# Altium schematic sheet CW521_BallisticGel_Connectors.SchDoc: SRAM Target for EM Fault Testing
size Letter; Organization: NewAE Technology Inc.; Address1: 1083 Queen St., Suite 196; Address2: Halifax; Address3: NS; Address4: Canada B3H 0B2; SheetApproved: YES
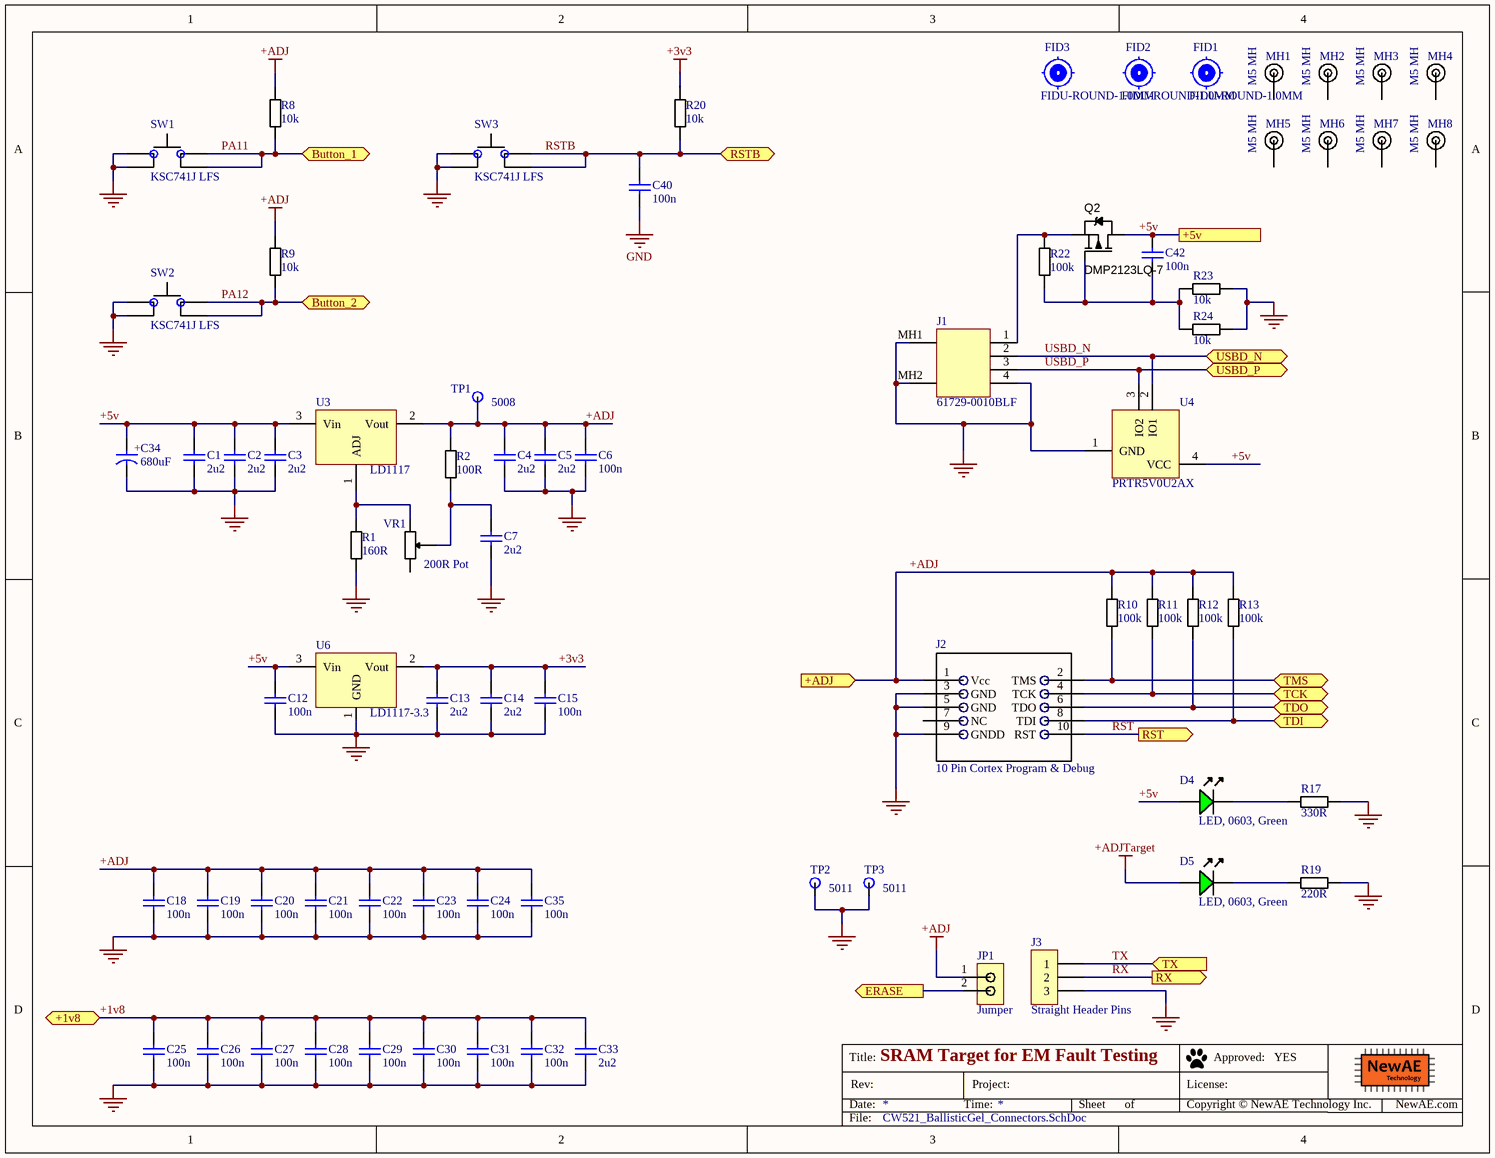
[diagram p0: CW521_BallisticGel_Connectors.SchDoc]

## Parts
C1  2u2  [CAPC0603_M]
C2  2u2  [CAPC0603_M]
C3  2u2  [CAPC0603_M]
C4  2u2  [CAPC0603_M]
C5  2u2  [CAPC0603_M]
C6  100n  [CAPC0603_M]
C7  2u2  [CAPC0603_M]
C12  100n  [CAPC0603_M]
C13  2u2  [CAPC0603_M]
C14  2u2  [CAPC0603_M]
C15  100n  [CAPC0603_M]
C18  100n  [CAPC0603_M]
C19  100n  [CAPC0603_M]
C20  100n  [CAPC0603_M]
C21  100n  [CAPC0603_M]
C22  100n  [CAPC0603_M]
C23  100n  [CAPC0603_M]
C24  100n  [CAPC0603_M]
C25  100n  [CAPC0603_M]
C26  100n  [CAPC0603_M]
C27  100n  [CAPC0603_M]
C28  100n  [CAPC0603_M]
C29  100n  [CAPC0603_M]
C30  100n  [CAPC0603_M]
C31  100n  [CAPC0603_M]
C32  100n  [CAPC0603_M]
C33  2u2  [CAPC0603_M]
C34  680uF  [Cap_16v_680uF]
C35  100n  [CAPC0603_M]
C40  100n  [CAPC0603_M]
C42  100n  [CAPC0603_M]
D4  LED, 0603, Green  [LED-0603-GREEN]
D5  LED, 0603, Green  [LED-0603-GREEN]
FID1  FIDU-ROUND-1.0MM  [FIDU-ROUND-1.0mm]  (no BOM)
FID2  FIDU-ROUND-1.0MM  [FIDU-ROUND-1.0mm]  (no BOM)
FID3  FIDU-ROUND-1.0MM  [FIDU-ROUND-1.0mm]  (no BOM)
J1  61729-0010BLF  [FCI-61729-0010BLF-6_V]
J2  10 Pin Cortex Program & Debug  [0.5mm_SMD_Header_5x2]
J3  Straight Header Pins  [1x3_Straight_pins]
JP1  Jumper  [2x2.54mm_Header]
MH1  M5 MH  [M5_MOUNTING_HOLE]
MH2  M5 MH  [M5_MOUNTING_HOLE]
MH3  M5 MH  [M5_MOUNTING_HOLE]
MH4  M5 MH  [M5_MOUNTING_HOLE]
MH5  M5 MH  [M5_MOUNTING_HOLE]
MH6  M5 MH  [M5_MOUNTING_HOLE]
MH7  M5 MH  [M5_MOUNTING_HOLE]
MH8  M5 MH  [M5_MOUNTING_HOLE]
Q2  DMP2123LQ-7  [SOT95P245X110-3M]
R1  160R  [RESC1608X55N]
R2  100R  [RESC1608X55N]
R8  10k  [RESC1608X55N]
R9  10k  [RESC1608X55N]
R10  100k  [RESC1608X55N]
R11  100k  [RESC1608X55N]
R12  100k  [RESC1608X55N]
R13  100k  [RESC1608X55N]
R17  330R  [RESC1608X55N]
R19  220R  [RESC1608X55N]
R20  10k  [RESC1608X55N]
R22  100k  [RESC1608X55N]
R23  10k  [RESC1608X55N]
R24  10k  [RESC1608X55N]
SW1  KSC741J LFS  [CK_KSC7J]
SW2  KSC741J LFS  [CK_KSC7J]
SW3  KSC741J LFS  [CK_KSC7J]
TP1  5008  [KEYSTONE5008]
TP2  5011  [KEYSTONE5011]
TP3  5011  [KEYSTONE5011]
U3  LD1117  [SOT-223]
U4  PRTR5V0U2AX  [SOT143B]
U6  LD1117-3.3  [SOT-223]
VR1  200R Pot  [Pot_TH_upright_3lead]

## Ports
+1v8 (bidir), +5v, +ADJ (in), Button_1 (bidir), Button_2 (bidir), ERASE (out), RST (out), RSTB (bidir), RX (out), TCK (bidir), TDI (bidir), TDO (bidir), TMS (bidir), TX (in), USBD_N (bidir), USBD_P (bidir)

## Nets
+3v3: C13.1 C14.1 C15.1 R20.1 U6.2(Vout)
+ADJ: C4.1 C5.1 C6.1 C18.1 C19.1 C20.1 C21.1 C22.1 C23.1 C24.1 C35.1 J2.1(Vcc) JP1.1 R2.1 R8.1 R9.1 R10.1 R11.1 R12.1 R13.1 TP1.1 U3.2(Vout) ; port +ADJ
+ADJTarget: D5.A
GND: C1.2 C2.2 C3.2 C4.2 C5.2 C6.2 C7.2 C12.2 C13.2 C14.2 C15.2 C18.2 C19.2 C20.2 C21.2 C22.2 C23.2 C24.2 C25.2 C26.2 C27.2 C28.2 C29.2 C30.2 C31.2 C32.2 C33.2 C34.2 C35.2 C40.2 J1.4 J1.MH1 J1.MH2 J2.3(GND) J2.5(GND) J2.9(GNDD) J3.3 R1.2 R17.2 R19.2 R23.2 R24.2 SW1.1(IN) SW1.4(IN) SW2.1(IN) SW2.4(IN) SW3.1(IN) SW3.4(IN) TP2.1 TP3.1 U4.1(GND) U6.1(GND)
+1v8: C25.1 C26.1 C27.1 C28.1 C29.1 C30.1 C31.1 C32.1 C33.1 ; port +1v8
+5v: C1.1 C2.1 C3.1 C12.1 C34.1 C42.1 D4.A Q2.3(D) U3.3(Vin) U4.4(VCC) U6.3(Vin) ; port +5v
ERASE: JP1.2 ; port ERASE
PA11: R8.2 SW1.2(IN) SW1.3(IN) ; port Button_1
PA12: R9.2 SW2.2(IN) SW2.3(IN) ; port Button_2
RST: J2.10(RST) ; port RST
RSTB: C40.1 R20.2 SW3.2(IN) SW3.3(IN) ; port RSTB
RX: J3.2 ; port RX
TCK: J2.4(TCK) R11.2 ; port TCK
TDI: J2.8(TDI) R13.2 ; port TDI
TDO: J2.6(TDO) R12.2 ; port TDO
TMS: J2.2(TMS) R10.2 ; port TMS
TX: J3.1 ; port TX
USBD_N: J1.2 U4.2(IO1) ; port USBD_N
USBD_P: J1.3 U4.3(IO2) ; port USBD_P
NetC7_1: C7.1 R2.2 VR1.2
NetC42_2: C42.2 Q2.1(G) R22.2 R23.1 R24.1
NetD4_K: D4.K R17.1
NetD5_K: D5.K R19.1
NetJ1_1: J1.1 Q2.2(S) R22.1
NetR1_1: R1.1 U3.1(ADJ) VR1.1

Not connected (* = marked no-connect by the designer): J2 7(NC); MH1 1; MH2 1; MH3 1; MH4 1; MH5 1; MH6 1; MH7 1; MH8 1; VR1 3

## Notes on the sheet
- Title:
- Date:
- Rev:
- Time:
- Project:
- Sheet
- of
- License:
- Copyright © NewAE Technology Inc.
- Approved:
- NewAE.com
- File:
- (in symbol Cap_16v_680uF) +

## Library data of the parts
C1-C5 C7 C13 C14 C33 = CCHIP-2u2-0603: 2u2, 0603; Manufacture 1: Samsung; Manufacture Part Number 1: CL10B225KP8NNNC; Component Group: Capacitor; Case-EIA: 0603; Case-Metric: 1608; Part Number: CCHIP-2u2-0603; Footprint: 0603; Pin Count: 2; Supplier 1: Digi-Key; Supplier Part Number 1: 1276-1134-2-ND; Value: 2u2; Mounting Technology: SMT; Component Kind: Standard; Component Type: Standard
C6 C12 C15 C18-C32 C35 C40 C42 = CCHIP-100n-0603: 100n, 0603; Manufacture 1: Kemet; Manufacture Part Number 1: C0603C104K5RACTU; Component Group: Capacitor; Case-EIA: 0603; Case-Metric: 1608; Rated Voltage: 50V; Part Number: CCHIP-100n-0603; Footprint: 0603; Pin Count: 2; Supplier 1: Digi-Key; Supplier Part Number 1: 399-5089-2-ND; Value: 100n; Mounting Technology: SMT; Component Kind: Standard; Component Type: Standard
C34 = Cap_16v_680uF: Aluminum electrolytic 680uF, 8x16mm, radial; Component Group: Capacitor; PP Material Stack: 0; Part Number: Cap_16v_680uF; Pin Count: 2; Value: 680uF; Mounting Technology: Through-hole; Component Kind: Standard; Component Type: Standard; PP Rotation: 0
D4 D5 = LEDCHIP_0603_GREEN: Chip LED, Green; Manufacture 1: Kingbright; Manufacture Part Number 1: APT1608CGCK; Component Group: Optical; PP Material Stack: 16; PP Rotation: -90; Part Number: LEDCHIP_0603_GREEN; Pin Count: 2; Supplier 1: Digi-Key; Supplier Part Number 1: 754-1116-1-ND; Mounting Technology: SMT; Component Kind: Standard; Component Type: Standard
FID1-FID3 = FIDU-ROUND-1.0MM: ROUND FIDUCIAL; Component Group: PCB Feature; Part Number: FIDU-ROUND-1.0MM; Pin Count: 0; Component Type: Standard (No BOM)
J1 = CMP-0397-00002-2: Single USB 2.0, B Type, Right Angle Jack, Through Hole, RoHS, Tube; Manufacturer: FCI Electronics; Number of Contacts: 4; Gender: Receptacle; Specifications: USB 2.0; Connector Type: USB-B; ComponentLink1URL: http://portal.fciconnect.com/; DatasheetVersion: Rev. V; PartNumber: 61729-0010BLF; ComponentLink3Description: Package Specification; PackageDescription: 6-Pin, Through Hole, Body 12.2 x 16 mm; Packing: Tube; ComponentLink2Description: Datasheet; Mounting Technology: Through Hole; PackageReference: 61729-0010BLF; ComponentLink1Description: Manufacturer URL; ComponentLink3URL: http://portal.fciconnect.com/Comergent//fci/drawing/61729.pdf; ComponentLink2URL: http://portal.fciconnect.com/Comergent//fci/drawing/61729.pdf; RoHS: TRUE; Supplier 1: Digi-Key; Supplier Part Number 1: 609-1039-ND
J2 = Cortex_Debug_Header_10Pin: 10 Pin Cortex Program & Debug 0.5mm pitch; Manufacture 1: Samtec Inc; Manufacture Part Number 1: FTSH-105-01-L-DV-007-K; Component Group: Connector; PP Material Stack: 0; Part Number: Cortex_Debug_Header_10Pin; Pin Count: 10; Supplier 1: Digi-Key; Supplier Part Number 1: SAM9438-ND; Mounting Technology: SMT; RoHS: Yes; Component Kind: Standard; Component Type: Standard; PP Rotation: 0
J3 = HDR_3PIN: 1x3 Straight pin header; Manufacture 1: Wurth Electronics Inc.; Manufacture Part Number 1: 61300311121; Component Group: Connector; PP Material Stack: 0; Part Number: HDR_3PIN; Pin Count: 3; Supplier 1: Digi-Key; Supplier Part Number 1: 732-5316-ND; Mounting Technology: Through-hole; RoHS: Yes; Component Kind: Standard; Component Type: Standard; PP Rotation: 0
JP1 = 2_PIN_JUMPER: 1x2 2.54mm header, male pins; Manufacture 1: Harwin; Manufacture Part Number 1: M20-9990246; Component Group: PCB Feature; PP Material Stack: 0; Part Number: 2_PIN_JUMPER; Pin Count: 2; Supplier 1: Digi-Key; Supplier Part Number 1: 952-2262-ND; Mounting Technology: Through-hole; RoHS: Yes; Component Kind: Standard; Component Type: Standard; PP Rotation: 0
MH1-MH8 = M5_Mounting_Hole: Machine screw #5 plated mounting hole; Component Group: Mechanical; PP Material Stack: 0; Part Number: M5_Mounting_Hole; Pin Count: 1; Component Kind: Mechanical; Component Type: Mechanical; PP Rotation: 0
Q2 = DMP2123LQ-7: P-Channel, 3A, Logic Level; Manufacture 1: Diodes Inc.; Component Group: MOSFET; Part Number: DMP2123LQ-7; Footprint: SOT23; Manufacture Part Number 1: DMP2123LQ-7; Pin Count: 3; Supplier 1: Digi-Key; Supplier Part Number 1: DMP2123LQ-7DICT-ND; Mounting Technology: SMT; Component Kind: Standard; Component Type: Standard
R1 = RCHIP-160R-0603: 160R res, 0603, 1%, 1/10W; Manufacture 1: Yageo; Manufacture Part Number 1: RC0603FR-07160RL; Component Group: Resistor; Case-EIA: 0603; Case-Metric: 1608; Rated Power: 0.1W; Rated Voltage: 75VDC; Part Number: RCHIP-160R-0603; Footprint: 0603; Pin Count: 2; Supplier 1: Digi-Key; Supplier Part Number 1: 311-160HRCT-ND; Value: 160R; Tolerance: 1%; Mounting Technology: SMT; Temperature Range: -55C to 155C; Component Kind: Standard; Component Type: Standard
R2 = RCHIP-100R-0603: 100R res, 0603, 1%, 1/10W; Manufacture 1: Yageo; Manufacture Part Number 1: RC0603FR-07100RL; Component Group: Resistor; Case-EIA: 0603; Case-Metric: 1608; Rated Power: 0.1W; Rated Voltage: 75VDC; Part Number: RCHIP-100R-0603; Footprint: 0603; Pin Count: 2; Supplier 1: Digi-Key; Supplier Part Number 1: 311-100HRCT-ND; Value: 100R; Tolerance: 1%; Mounting Technology: SMT; Temperature Range: -55C to 155C; Component Kind: Standard; Component Type: Standard
R8 R9 R20 R23 R24 = RCHIP-10K-0603: 10k res, 0603, 1%, 1/10W; Manufacture 1: Yageo; Manufacture Part Number 1: RC0603FR-0710KL; Component Group: Resistor; Case-EIA: 0603; Case-Metric: 1608; Rated Power: 0.1W; Rated Voltage: 75VDC; Part Number: RCHIP-10K-0603; Footprint: 0603; Pin Count: 2; Supplier 1: Digi-Key; Supplier Part Number 1: 311-10.0KHRCT-ND; Value: 10k; Tolerance: 1%; Mounting Technology: SMT; Temperature Range: -55C to 155C; Component Kind: Standard; Component Type: Standard
R10-R13 R22 = RCHIP-100K-0603: 100k res, 0603, 1%, 1/10W; Manufacture 1: Yageo; Manufacture Part Number 1: RC0603FR-07100KL; Component Group: Resistor; Case-EIA: 0603; Case-Metric: 1608; Rated Power: 0.1W; Rated Voltage: 75VDC; Part Number: RCHIP-100K-0603; Footprint: 0603; Pin Count: 2; Supplier 1: Digi-Key; Supplier Part Number 1: 311-100KHRCT-ND; Value: 100k; Tolerance: 1%; Mounting Technology: SMT; Temperature Range: -55C to 155C; Component Kind: Standard; Component Type: Standard
R17 = RCHIP-330R-0603: 330R res, 0603, 1%, 1/10W; Manufacture 1: Yageo; Manufacture Part Number 1: RC0603FR-07330RL; Component Group: Resistor; Case-EIA: 0603; Case-Metric: 1608; Rated Power: 0.1W; Rated Voltage: 75VDC; Part Number: RCHIP-330R-0603; Footprint: 0603; Pin Count: 2; Supplier 1: Digi-Key; Supplier Part Number 1: 311-330HRCT-ND; Value: 330R; Tolerance: 1%; Mounting Technology: SMT; Temperature Range: -55C to 155C; Component Kind: Standard; Component Type: Standard
R19 = RCHIP-220R-0603: 220R res, 0603, 1%, 1/10W; Manufacture 1: Yageo; Manufacture Part Number 1: RC0603FR-07220RL; Component Group: Resistor; Case-EIA: 0603; Case-Metric: 1608; Rated Power: 0.1W; Rated Voltage: 75VDC; Part Number: RCHIP-220R-0603; Footprint: 0603; Pin Count: 2; Supplier 1: Digi-Key; Supplier Part Number 1: 311-220HRCT-ND; Value: 220R; Tolerance: 1%; Mounting Technology: SMT; Temperature Range: -55C to 155C; Component Kind: Standard; Component Type: Standard
SW1-SW3 = TACTSW-KSC741J: SWITCH TACTILE SPST-NO 0.01A 32V; Manufacture 1: C&K; PP Material Stack: 0; Part Number: TACTSW-KSC741J; Component Group: Switch; Manufacture Part Number 1: KSC741J LFS; Pin Count: 4; Supplier 1: Digi-Key; Supplier Part Number 1: CKN10309CT-ND; Mounting Technology: SMT; RoHS: Yes; Component Kind: Standard; Component Type: Standard; PP Rotation: 0
TP1 = KEYSTONE_5008: TEST POINT PC COMPACT .063"D ORG; Supplier 1: Digi-Key; Supplier Part Number 1: 36-5008-ND; Part Number: KEYSTONE_5008; Component Group: Test Point; Pin Count: 1; Mounting Technology: Through-hole; Component Kind: Standard; Component Type: Standard
TP2 TP3 = KEYSTONE_5011: TEST POINT PC MULTI PURPOSE BLK; Supplier 1: Digi-Key; Supplier Part Number 1: 36-5011-ND; Part Number: KEYSTONE_5011; Component Group: Test Point; Pin Count: 1; Mounting Technology: Through-hole; Component Kind: Standard; Component Type: Standard
U3 = LD1117SC-R: IC REG LIN POS ADJ 800MA SOT223; Manufacture 1: STMicroelectronics; Component Group: Analog IC; Rated Voltage: 15V; PP Material Stack: 0; Part Number: LD1117SC-R; Manufacture Part Number 1: LD1117SC-R; Pin Count: 3; Supplier 1: Digi-Key; Supplier Part Number 1: 497-4241-1-ND; Mounting Technology: SMT; RoHS: Yes; Component Kind: Standard; Component Type: Standard; PP Rotation: 0
U4 = PRTR5V0U2AX: USB 2.0 high-speed ESD; Component Group: Diode; Supplier 1: Digi-Key; Supplier Part Number 1: 568-7445-1-ND; Part Number: PRTR5V0U2AX; Pin Count: 4; Component Kind: Standard; Component Type: Standard
U6 = LD1117S33: IC REG LIN POS 3.3V 800MA SOT223; Manufacture 1: STMicroelectronics; Manufacture Part Number 1: LD1117S33TR; Manufacture Part Number 2: LT1117CST-3.3#PBF; Manufacture 2: Linear; Component Group: Analog IC; Rated Voltage: 15V; PP Material Stack: 0; Part Number: LD1117S33; Pin Count: 3; Supplier 1: Digi-Key; Supplier Part Number 1: 497-1242-1-ND; Mounting Technology: SMT; RoHS: Yes; Component Kind: Standard; Component Type: Standard; PP Rotation: 0; Supplier 2: Digi-Key; Supplier Part Number 2: LT1117CST-3.3#PBF-ND
VR1 = CT94EW201: 200R, 18 turn, 0.5W; Manufacture 1: Nidec Copal Electronics; Component Group: Resistor; PP Material Stack: 0; Part Number: CT94EW201; Manufacture Part Number 1: CT94EW201; Pin Count: 3; Supplier 1: Digi-Key; Supplier Part Number 1: CT94EW201-ND; Mounting Technology: Through-hole; Component Kind: Standard; Component Type: Standard; PP Rotation: 0